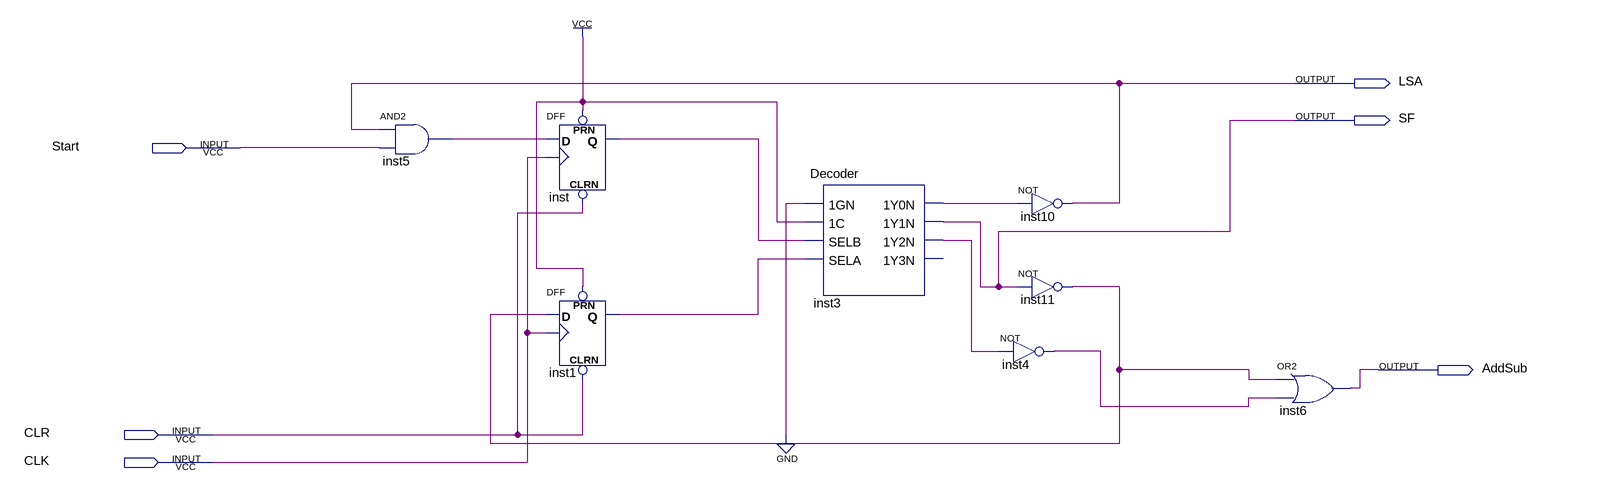
[diagram p0: schematic sheet]
// Quartus schematic ControlUnit.bdf as structural Verilog: 8 symbols, 6 pins
module ControlUnit (
  input  Start,
  input  CLR,
  input  CLK,
  output LSA,
  output SF,
  output AddSub
);

  wire inst1_q, inst3_1y0n, inst3_1y2n, inst4_out, inst5_out, inst11_out, inst_q;

  and inst5 (inst5_out, LSA, Start);
  DFF inst (.CLRN(CLR), .CLK(CLK), .D(inst5_out), .PRN(1'b1), .Q(inst_q));
  DFF inst1 (.CLRN(CLR), .CLK(CLK), .D(inst11_out), .PRN(1'b1), .Q(inst1_q));
  Decoder inst3 (
    .\1GN (1'b0), .\1C (1'b1), .SELB(inst_q), .SELA(inst1_q), .\1Y0N (inst3_1y0n), .\1Y1N (SF),
    .\1Y2N (inst3_1y2n));  // open: 1Y3N
  not inst10 (LSA, inst3_1y0n);
  not inst11 (inst11_out, SF);
  not inst4 (inst4_out, inst3_1y2n);
  or inst6 (AddSub, inst11_out, inst4_out);
endmodule
